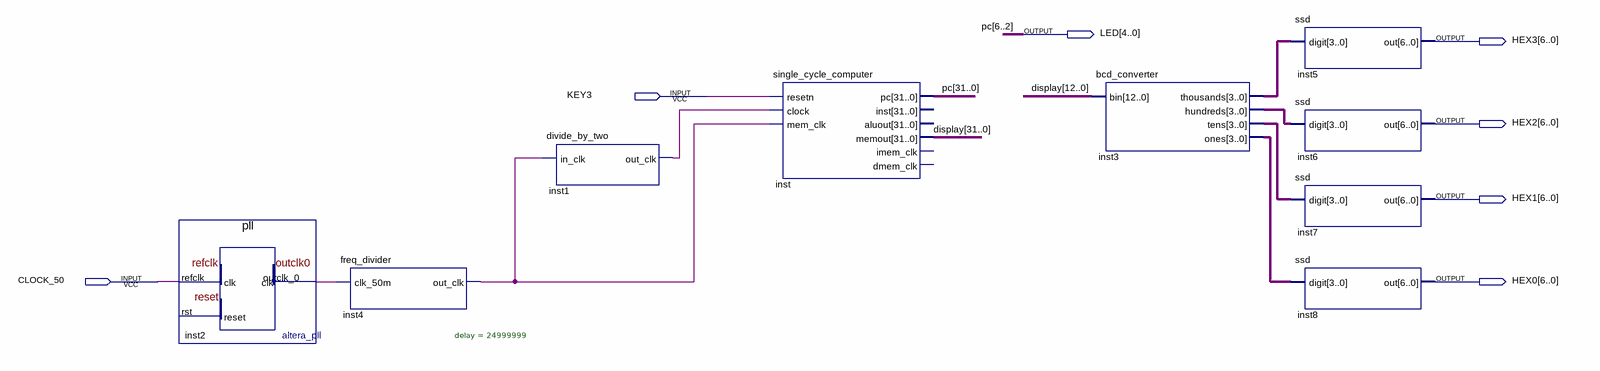
[diagram p0: schematic sheet]
// Quartus schematic sc_computer.bdf as structural Verilog: 9 symbols, 7 pins
module sc_computer (
  input  KEY3,
  input  CLOCK_50,
  output [4:0] LED,
  output [6:0] HEX3,
  output [6:0] HEX2,
  output [6:0] HEX1,
  output [6:0] HEX0
);

  wire inst1_out_clk, inst2_outclk_0, inst4_out_clk;
  wire [3:0] inst3_hundreds, inst3_ones, inst3_tens, inst3_thousands;
  wire [31:0] display, pc;

  pll inst2 (.refclk(CLOCK_50), .outclk_0(inst2_outclk_0));  // open: rst
  freq_divider #(.delay(24999999)) inst4 (.clk_50m(inst2_outclk_0), .out_clk(inst4_out_clk));
  divide_by_two inst1 (.in_clk(inst4_out_clk), .out_clk(inst1_out_clk));
  single_cycle_computer inst (
    .resetn(KEY3), .clock(inst1_out_clk), .mem_clk(inst4_out_clk), .pc({pc[31:7], LED, pc[1:0]}),
    .memout(display));  // open: inst, aluout, imem_clk, dmem_clk
  bcd_converter inst3 (
    .bin(display[12:0]), .thousands(inst3_thousands), .hundreds(inst3_hundreds), .tens(inst3_tens),
    .ones(inst3_ones));
  ssd inst5 (.digit(inst3_thousands), .out(HEX3));
  ssd inst6 (.digit(inst3_hundreds), .out(HEX2));
  ssd inst7 (.digit(inst3_tens), .out(HEX1));
  ssd inst8 (.digit(inst3_ones), .out(HEX0));

  // Other names for the same wires on the sheet: pc[6:2] = LED
endmodule
